# Altium schematic sheet Sheet6.SchDoc
size A
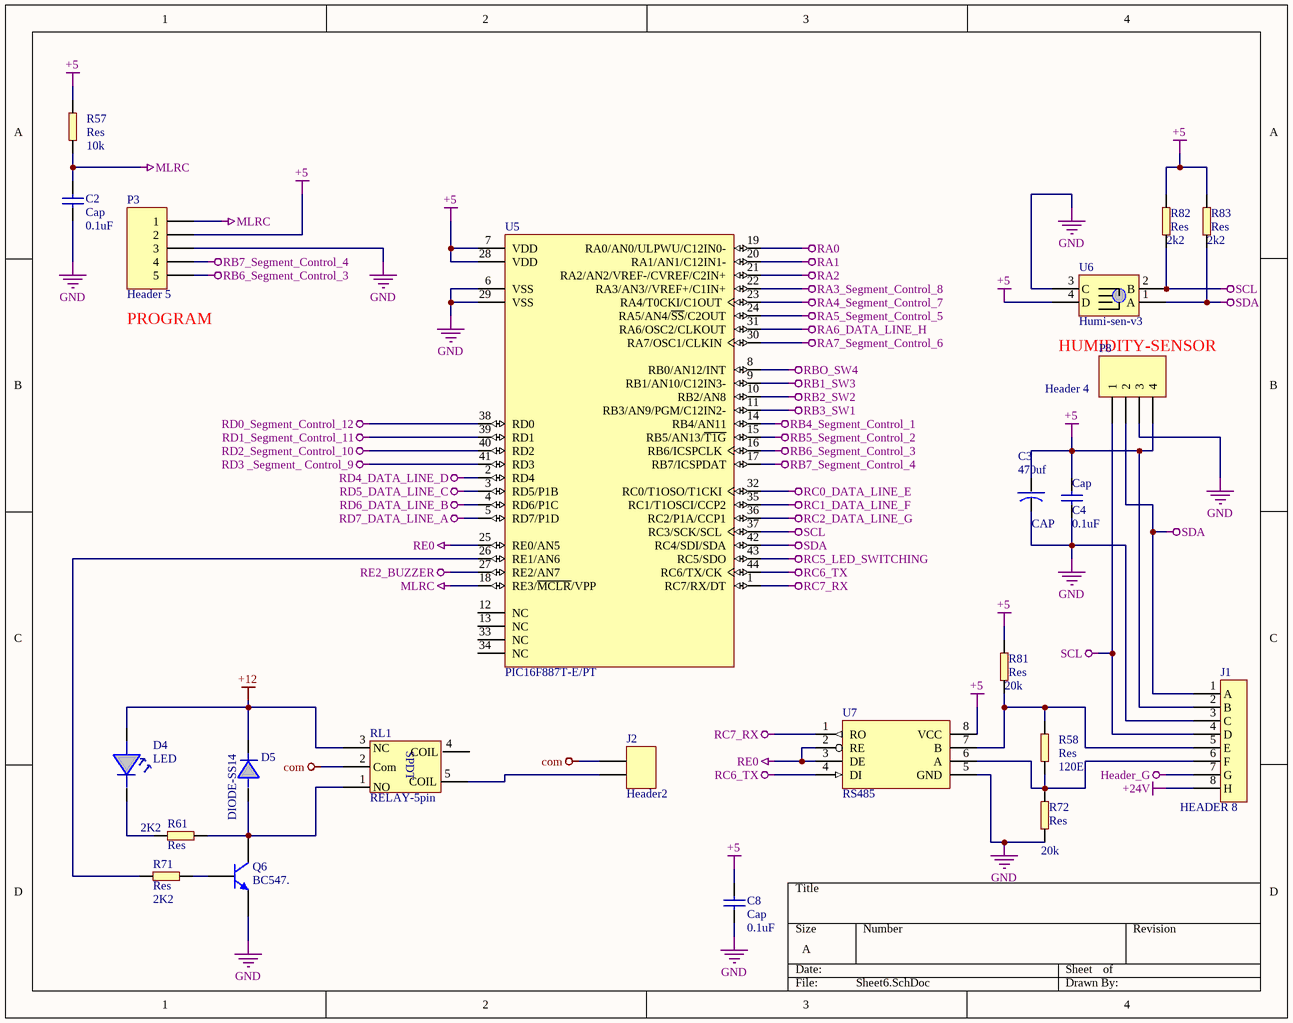
[diagram p0: Sheet6.SchDoc]

## Parts
C2  Cap  [RES0805]
C3  CAP  value 470uf  [Capacitor]
C4  Cap  [RES0805]
C8  Cap  [RES0805]
D4  LED  [0805_led]
D5  DIODE-SS14  [DO-214AC]
J1  HEADER 8  [HEADER AC]
J2  Header2  [Header2]
P3  Header 5  [HDR1X5]
P8  Header 4  [HDR1X4]
Q6  BC547.  [SOT23_L]
R57  Res  value 10k  [RES0805]
R58  Res  value 120E  [RES0805]
R61  Res  value 2K2  [RES0805]
R71  Res  value 2K2  [RES0805]
R72  Res  value 20k  [RES0805]
R81  Res  value 20k  [RES0805]
R82  Res  value 2k2  [RES0805]
R83  Res  value 2k2  [RES0805]
RL1  RELAY-5pin  [RELAY-5pin]
U5  PIC16F887T-E/PT  [TQFP-PT44_N]
U6  Humi-sen-v3  [HUMI-SEN]
U7  RS485  [RS485]

## Nets
+5: C3.1(a) C4.1(A) C8.1(A) J1.2(B) P3.2 P8.4 R57.2(b) R81.1(a) R82.1(a) R83.1(a) U5.7(VDD) U5.28(VDD) U6.4(D) U7.8(VCC)
+12: D4.1(A) D5.2(B) RL1.3(NC)
+24V: J1.8(H)
com: J2.1 RL1.2(Com)
GND: C2.1(A) C3.2(b) C4.2(A) C8.2(A) J1.3(C) P3.3 P8.3 Q6.2(E) R72.1(a) U5.6(VSS) U5.29(VSS) U6.3(C) U7.5(GND)
Header_G: J1.7(G)
MLRC: C2.2(A) P3.1 R57.1(a) U5.18(RE3/~{MCLR}/VPP)
RA0: U5.19(RA0/AN0/ULPWU/C12IN0-)
RA1: U5.20(RA1/AN1/C12IN1-)
RA2: U5.21(RA2/AN2/VREF-/CVREF/C2IN+)
RA3_Segment_Control_8: U5.22(RA3/AN3//VREF+/C1IN+)
RA4_Segment_Control_7: U5.23(RA4/T0CKI/C1OUT)
RA5_Segment_Control_5: U5.24(RA5/AN4/~{SS}/C2OUT)
RA6_DATA_LINE_H: U5.31(RA6/OSC2/CLKOUT)
RA7_Segment_Control_6: U5.30(RA7/OSC1/CLKIN)
RB1_SW3: U5.9(RB1/AN10/C12IN3-)
RB2_SW2: U5.10(RB2/AN8)
RB3_SW1: U5.11(RB3/AN9/PGM/C12IN2-)
RB4_Segment_Control_1: U5.14(RB4/AN11)
RB5_Segment_Control_2: U5.15(RB5/AN13/~{T1G})
RB6_Segment_Control_3: P3.5 U5.16(RB6/ICSPCLK)
RB7_Segment_Control_4: P3.4 U5.17(RB7/ICSPDAT)
RBO_SW4: U5.8(RB0/AN12/INT)
RC0_DATA_LINE_E: U5.32(RC0/T1OSO/T1CKI)
RC1_DATA_LINE_F: U5.35(RC1/T1OSCI/CCP2)
RC2_DATA_LINE_G: U5.36(RC2/P1A/CCP1)
RC5_LED_SWITCHING: U5.43(RC5/SDO)
RC6_TX: U5.44(RC6/TX/CK) U7.4(DI)
RC7_RX: U5.1(RC7/RX/DT) U7.1(RO)
RD0_Segment_Control_12: U5.38(RD0)
RD1_Segment_Control_11: U5.39(RD1)
RD2_Segment_Control_10: U5.40(RD2)
RD3 _Segment_ Control_9: U5.41(RD3)
RD4_DATA_LINE_D: U5.2(RD4)
RD5_DATA_LINE_C: U5.3(RD5/P1B)
RD6_DATA_LINE_B: U5.4(RD6/P1C)
RD7_DATA_LINE_A: U5.5(RD7/P1D)
RE0: U5.25(RE0/AN5) U7.2(RE) U7.3(DE)
RE2_BUZZER: U5.27(RE2/AN7)
SCL: J1.4(D) P8.1 R82.2(b) U5.37(RC3/SCK/SCL) U6.2(B)
SDA: J1.1(A) P8.2 R83.2(b) U5.42(RC4/SDI/SDA) U6.1(A)
NetD4_2: D4.2(B) R61.2(b)
NetD5_1: D5.1(A) Q6.3(C) R61.1(a) RL1.1(NO)
NetJ1_5: J1.5(E) R58.2(b) R81.2(b) U7.7(B)
NetJ1_6: J1.6(F) R58.1(a) R72.2(b) U7.6(A)
NetJ2_2: J2.2 RL1.5(COIL)
NetQ6_1: Q6.1(B) R71.1(a)
NetR71_2: R71.2(b) U5.26(RE1/AN6)

Not connected (* = marked no-connect by the designer): RL1 4(COIL); U5 12(NC) 13(NC) 33(NC) 34(NC)

## Notes on the sheet
- (near P3) PROGRAM
- HUMIDITY-SENSOR
- (in symbol CAP_104_SMD) 0.1uF
- (in symbol RELAY-5pin) SPDT

## Library data of the parts
C2 C4 C8 = CAP_104_SMD
C3 = CAP_GT_SMD: 470uf
D4 = LED_0805
D5 = DIODE-SS14: SS14
J1 = HEADER 8: AC
P3 = Header 5: Header, 5-Pin; LatestRevisionDate: 17-Jul-2002; LatestRevisionNote: Re-released for DXP Platform.; Publisher: Altium Limited
P8 = Header 4: Header, 4-Pin; LatestRevisionDate: 17-Jul-2002; LatestRevisionNote: Re-released for DXP Platform.; Publisher: Altium Limited
Q6 = BC547.: NPN 1 GHz Wideband Transistor
R57 R58 R61 R71 R72 R81-R83 = Resistor: Res0805
U5 = PIC16F887T-E/PT: Flash-Based, 8-Bit CMOS Microcontroller with nanoWatt Technology, 8K (x14-Bit words) Program Memory, 624 Bytes Data Memory, 35 I/O pins, 44-Pin TQFP, Standard VDD Range, Extended Temperature, Tape and Reel; Published: 29-Jan-2009; LatestRevisionDate: 02-Dec-2009; LatestRevisionNote: Updated datasheet to version revF, Apr-2009.; DatasheetVersion: revF, Apr-2009; PackageVersion: revBB, Aug-2009; PackageReference: TQFP-PT44; Publisher: Altium Limited; PackageDescription: 44-Lead Plastic Thin Quad Flatpack (PT) - 10x10x1mm Body, 2.00mm [TQFP]; Code_JEDEC: MS-026; ComponentLink1Description: Datasheet; ComponentLink1URL: http://ww1.microchip.com/downloads/en/DeviceDoc/41291F.pdf; ComponentLink2Description: Packaging Specification; ComponentLink2URL: http://www.microchip.com/stellent/groups/techpub_sg/documents/packagingspec/en012702.pdf; ComponentLink3Description: Microchip.com Home; ComponentLink3URL: http://www.microchip.com/
U7 = RS485: 8-Pin SO